# EAGLE design sensorHub (EAGLE 9.2.2)
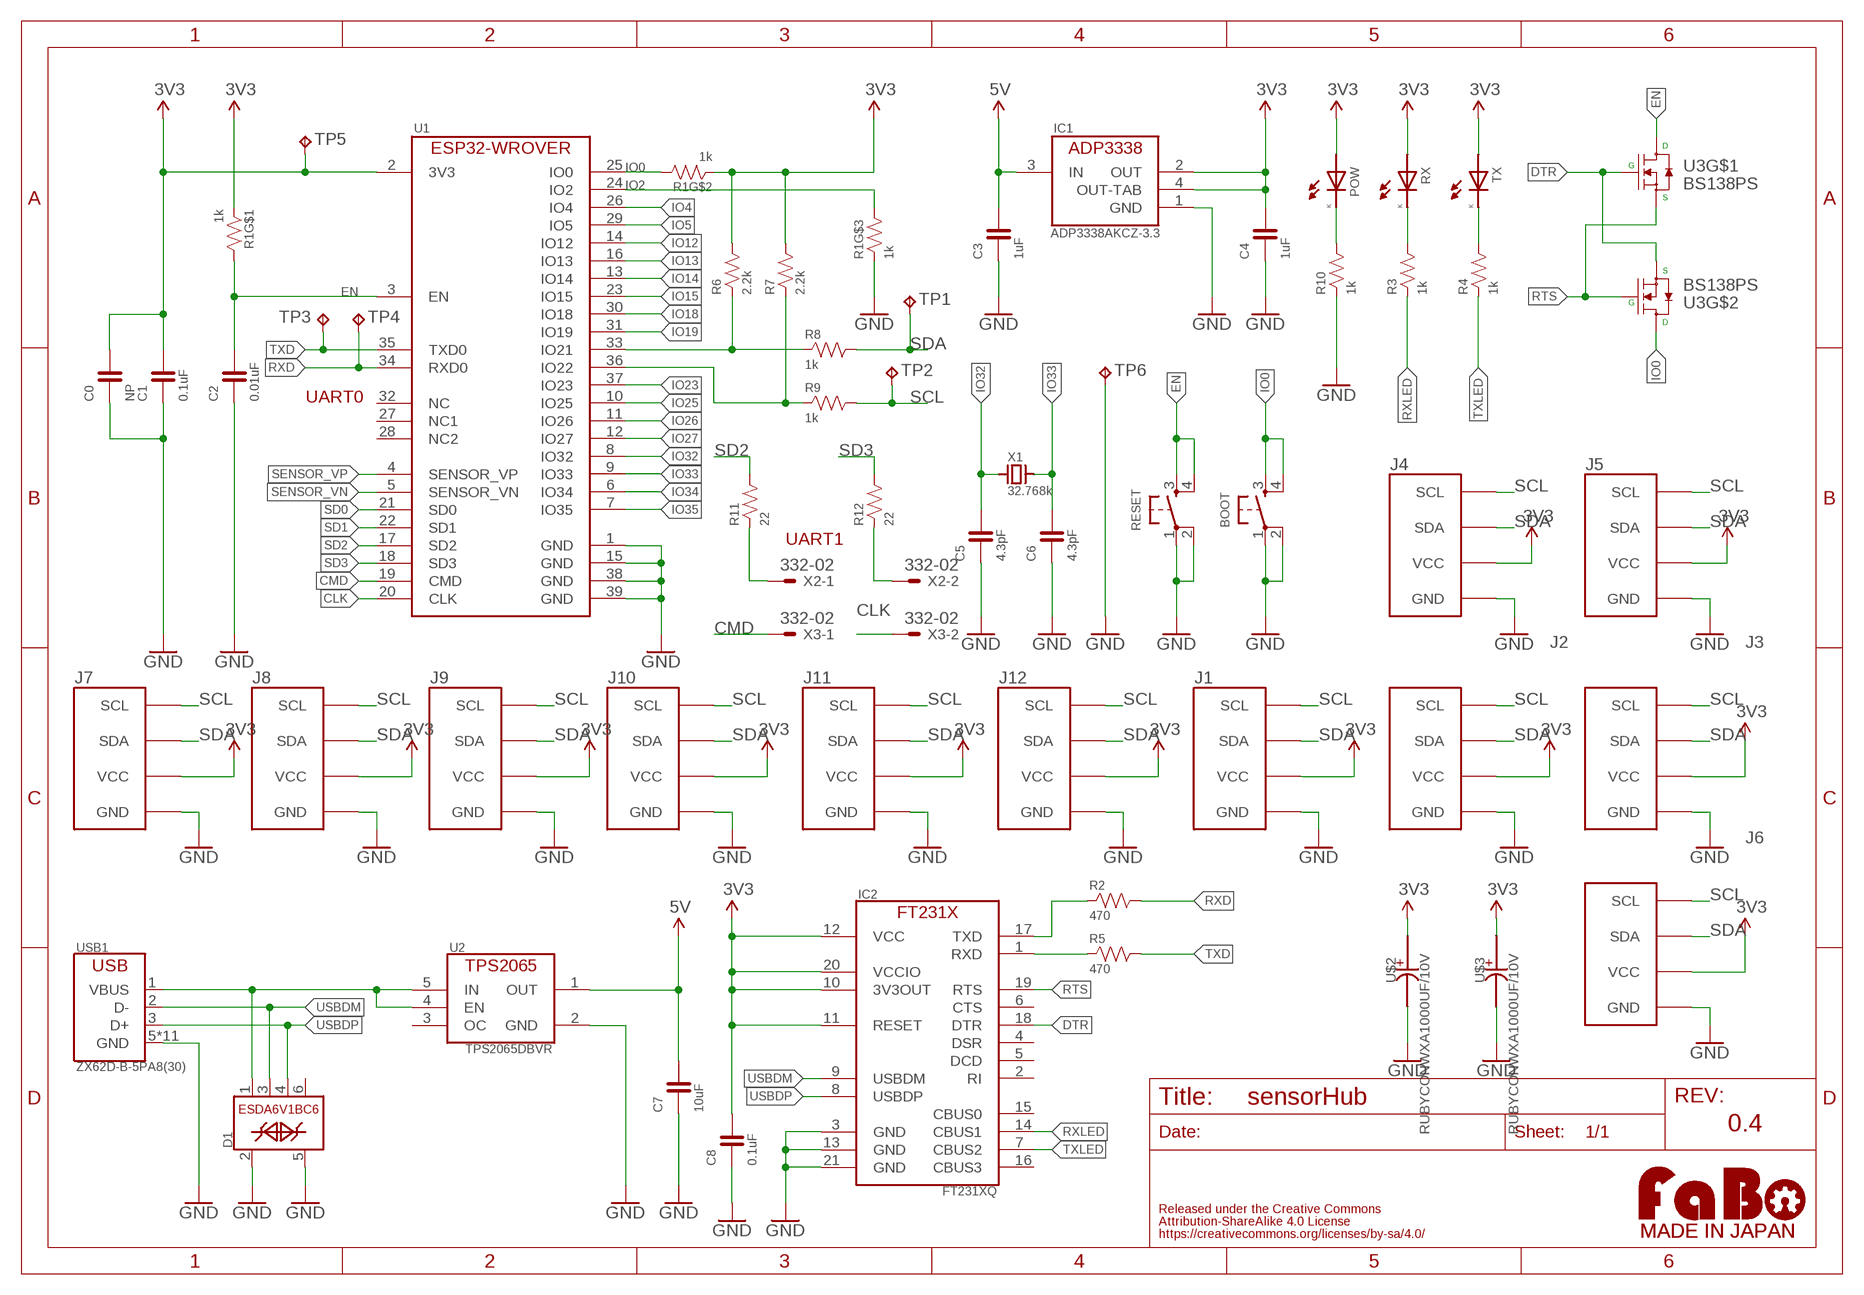
[diagram p0: schematic, sheet 1]

## Parts
BOOT  TACTILE-KMR2  [KMR2-TACT]
C0  NP  CAPACITOR-M  [MULTIPAD0603]
C1  0.1uF  CAPACITOR-0603  [EIA0603]
C2  0.01uF  CAPACITOR-0603  [EIA0603]
C3  1uF  CAPACITOR-0603  [EIA0603]
C4  1uF  CAPACITOR-0603  [EIA0603]
C5  4.3pF  CAPACITOR-0603  [EIA0603]
C6  4.3pF  CAPACITOR-0603  [EIA0603]
C7  10uF  CAPACITOR-0603  [EIA0603]
C8  0.1uF  CAPACITOR-0603  [EIA0603]
D1  ESDA6V1BC6  [SOT-23-6L]
IC1  ADP3338AKCZ-3.3  ADP3338AKCZ  [SOT-223-KC3]
IC2  FT231XQ  [QFN-20]
J1  FABO_BRICK_I2C-S04B-PASK-2  [FABO_BRICK_I2C_S04B-PASK-2]
J2  FABO_BRICK_I2C-S04B-PASK-2  [FABO_BRICK_I2C_S04B-PASK-2]
J3  FABO_BRICK_I2C-S04B-PASK-2  [FABO_BRICK_I2C_S04B-PASK-2]
J4  FABO_BRICK_I2C-S04B-PASK-2  [FABO_BRICK_I2C_S04B-PASK-2]
J5  FABO_BRICK_I2C-S04B-PASK-2  [FABO_BRICK_I2C_S04B-PASK-2]
J6  FABO_BRICK_I2C-S04B-PASK-2  [FABO_BRICK_I2C_S04B-PASK-2]
J7  FABO_BRICK_I2C-S04B-PASK-2  [FABO_BRICK_I2C_S04B-PASK-2]
J8  FABO_BRICK_I2C-S04B-PASK-2  [FABO_BRICK_I2C_S04B-PASK-2]
J9  FABO_BRICK_I2C-S04B-PASK-2  [FABO_BRICK_I2C_S04B-PASK-2]
J10  FABO_BRICK_I2C-S04B-PASK-2  [FABO_BRICK_I2C_S04B-PASK-2]
J11  FABO_BRICK_I2C-S04B-PASK-2  [FABO_BRICK_I2C_S04B-PASK-2]
J12  FABO_BRICK_I2C-S04B-PASK-2  [FABO_BRICK_I2C_S04B-PASK-2]
LOGO1  LOGO_FABO-M_BOTTOM  [LOGO_FABO_M_BOTTOM]
POW  LED-0603  [LED_0603]
R1  1k  RESISTOR_ARRAY  [EXBV8V]
R2  470  RESISTOR-0603  [EIA0603]
R3  1k  RESISTOR-0603  [EIA0603]
R4  1k  RESISTOR-0603  [EIA0603]
R5  470  RESISTOR-0603  [EIA0603]
R6  2.2k  RESISTOR-0603  [EIA0603]
R7  2.2k  RESISTOR-0603  [EIA0603]
R8  1k  RESISTOR-0603  [EIA0603]
R9  1k  RESISTOR-0603  [EIA0603]
R10  1k  RESISTOR-0603  [EIA0603]
R11  22  RESISTOR-0603  [EIA0603]
R12  22  RESISTOR-0603  [EIA0603]
RESET  TACTILE-KMR2  [KMR2-TACT]
RX  LED-0603  [LED_0603]
TP1  TPB1,27  [B1,27]
TP2  TPB1,27  [B1,27]
TP3  TPB1,27  [B1,27]
TP4  TPB1,27  [B1,27]
TP5  TPB1,27  [B1,27]
TP6  TPB1,27  [B1,27]
TX  LED-0603  [LED_0603]
U1  ESP32-WROVER-B  [ESP32-WROVER-B]
U2  TPS2065DBVR  TPS2065DBV  [SOT-23-5]
U3  BS138PS  [SOT-363]
U$2  RUBYCONWXA1000UF/10V  [ALUMINUM10*9]
U$3  RUBYCONWXA1000UF/10V  [ALUMINUM10*9]
USB1  ZX62D-B-5PA8(30)  USB-ZX62D  [ZX62D-B-5PA8]
X1  32.768k  CRYSTAL-ABS07  [ABS07]
X2  332-02  [332-02]
X3  332-02  [332-02]

## Nets
3V3: C0.2 C1.2 C4.2 C8.2 IC1.2(OUT) IC1.4(OUT-TAB) IC2.10(3V3OUT) IC2.11(RESET) IC2.12(VCC) IC2.20(VCCIO) J1.VCC J2.VCC J3.VCC J4.VCC J5.VCC J6.VCC J7.VCC J8.VCC J9.VCC J10.VCC J11.VCC J12.VCC POW.A(ANODE) R1.1 R1.2 R6.2 R7.2 RX.A(ANODE) TP5.TP TX.A(ANODE) U1.2(3V3) U$2.PLUS(+) U$3.PLUS(+)
5V: C3.2 C7.2 IC1.3(IN) U2.1(OUT)
CLK: U1.20(CLK) X3.2
CMD: U1.19(CMD) X3.1
DTR: IC2.18(DTR) U3.2(G) U3.4(S)
EN: C2.2 R1.8 RESET.3 RESET.4 U1.3(EN) U3.6(D)
GND: BOOT.1 BOOT.2 C0.1 C1.1 C2.1 C3.1 C4.1 C5.1 C6.1 C7.1 C8.1 D1.2 D1.5 IC1.1(GND) IC2.3(GND) IC2.13(GND) IC2.21(GND) J1.GND J2.GND J3.GND J4.GND J5.GND J6.GND J7.GND J8.GND J9.GND J10.GND J11.GND J12.GND R1.3 R10.1 RESET.1 RESET.2 TP6.TP U1.1(GND) U1.15(GND) U1.38(GND) U1.39(GND) U2.2(GND) U$2.MINUS(-) U$3.MINUS(-) USB1.5(GND) USB1.B1(GND) USB1.B2(GND) USB1.B3(GND) USB1.B4(GND) USB1.T1(GND) USB1.T2(GND) USB1.T3(GND) USB1.T4(GND) USB1.T5(GND) USB1.T6(GND)
IO0: BOOT.3 BOOT.4 R1.7 U1.25(IO0) U3.3(D)
IO2: R1.6 U1.24(IO2)
IO4: U1.26(IO4)
IO5: U1.29(IO5)
IO12: U1.14(IO12)
IO13: U1.16(IO13)
IO14: U1.13(IO14)
IO15: U1.23(IO15)
IO18: U1.30(IO18)
IO19: U1.31(IO19)
IO23: U1.37(IO23)
IO25: U1.10(IO25)
IO26: U1.11(IO26)
IO27: U1.12(IO27)
IO32: C5.2 U1.8(IO32) X1.1
IO33: C6.2 U1.9(IO33) X1.2
IO34: U1.6(IO34)
IO35: U1.7(IO35)
LED1K: POW.K(CATHODE) R10.2
LED2K1: R3.2 RX.K(CATHODE)
LED2K2: R4.2 TX.K(CATHODE)
N$1: IC2.1(RXD) R5.1
N$2: R11.1 X2.1
N$3: IC2.17(TXD) R2.1
N$4: R12.1 X2.2
N$5: R6.1 R8.1 U1.33(IO21)
N$6: R7.1 R9.1 U1.36(IO22)
RTS: IC2.19(RTS) U3.1(S) U3.5(G)
RXD: R2.2 TP4.TP U1.34(RXD0)
RXLED: IC2.14(CBUS1) R3.1
SCL: J1.SCL J2.SCL J3.SCL J4.SCL J5.SCL J6.SCL J7.SCL J8.SCL J9.SCL J10.SCL J11.SCL J12.SCL R9.2 TP2.TP
SD0: U1.21(SD0)
SD1: U1.22(SD1)
SD2: R11.2 U1.17(SD2)
SD3: R12.2 U1.18(SD3)
SDA: J1.SDA J2.SDA J3.SDA J4.SDA J5.SDA J6.SDA J7.SDA J8.SDA J9.SDA J10.SDA J11.SDA J12.SDA R8.2 TP1.TP
SENSOR_VN: U1.5(SENSOR_VN)
SENSOR_VP: U1.4(SENSOR_VP)
TXD: R5.2 TP3.TP U1.35(TXD0)
TXLED: IC2.7(CBUS2) R4.1
USBDM: D1.3 IC2.9(USBDM) USB1.2(D-)
USBDP: D1.4 IC2.8(USBDP) USB1.3(D+)
USBVBUS: D1.1 U2.4(EN) U2.5(IN) USB1.1(VBUS)
Unconnected: D1.6 IC2.2(RI) IC2.4(DSR) IC2.5(DCD) IC2.6(CTS) IC2.15(CBUS0) IC2.16(CBUS3) R1.4 R1.5 U1.27(NC1) U1.28(NC2) U1.32(NC) U2.3(OC)

## Notes on the sheet
- UART0
- UART1
- 0.4

## Library data of the parts
BOOT RESET = component:TACTILE
C0 C1-C8 = component:CAPACITOR
D1 = component:ESDA6V1BC6
IC1 = component:ADP3338AKCZ
IC2 = component:FT231X
J1-J12 = FaBo-Template:FABO_BRICK_I2C: FaBo Brick I2C
LOGO1 = component:LOGO_FABO
POW RX TX = component:LED
R1 = component:RESISTOR_ARRAY
R2-R12 = component:RESISTOR
TP1-TP6 = testpad:TP: Test pad
U1 = component:ESP32-WROVER-B
U2 = component:TPS2065
U3 = component:BS138PS
U$2 U$3 = FaBo-Capacitor:RUBYCONWXA1000UF/10V
USB1 = component:USB
X1 = component:CRYSTAL
X2 X3 = con-garry:332-02: 2 Pin - 2mm Dual Row Source: www.mpe-connector.de / garry_shortform_2012.pdf

## Board
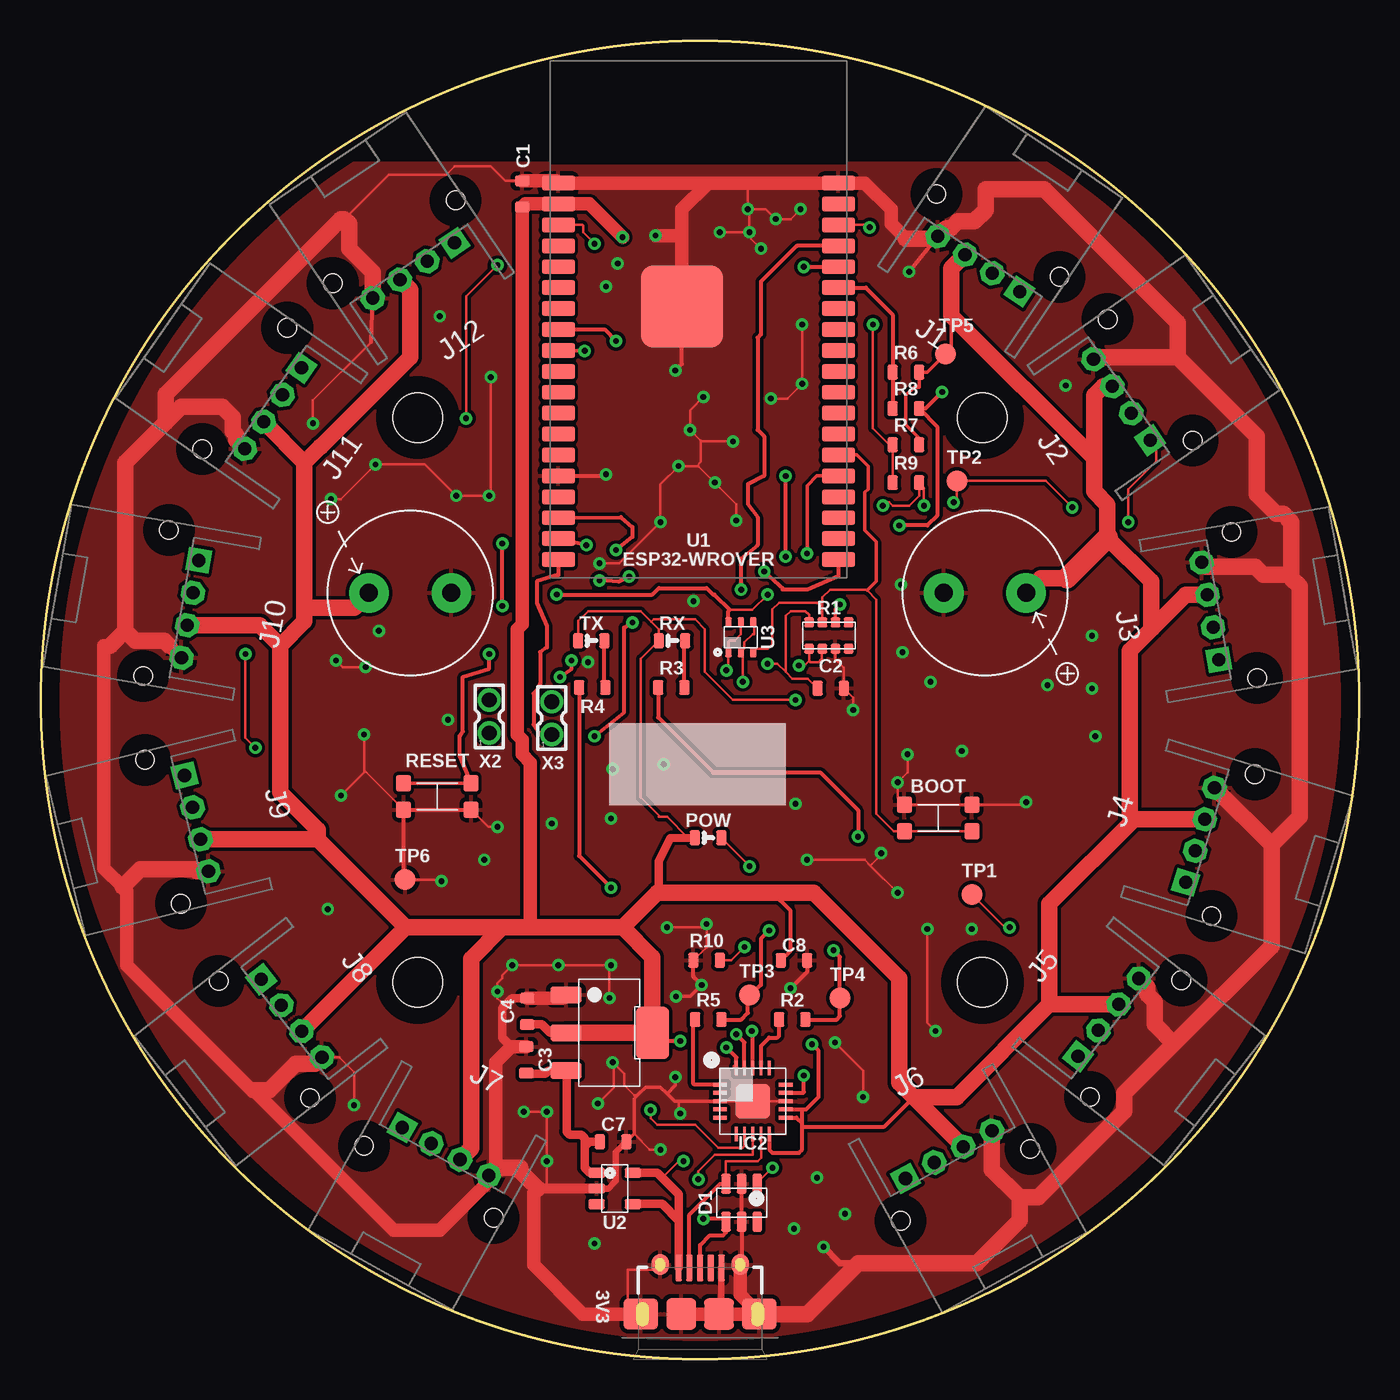
[diagram p1: board, top side]
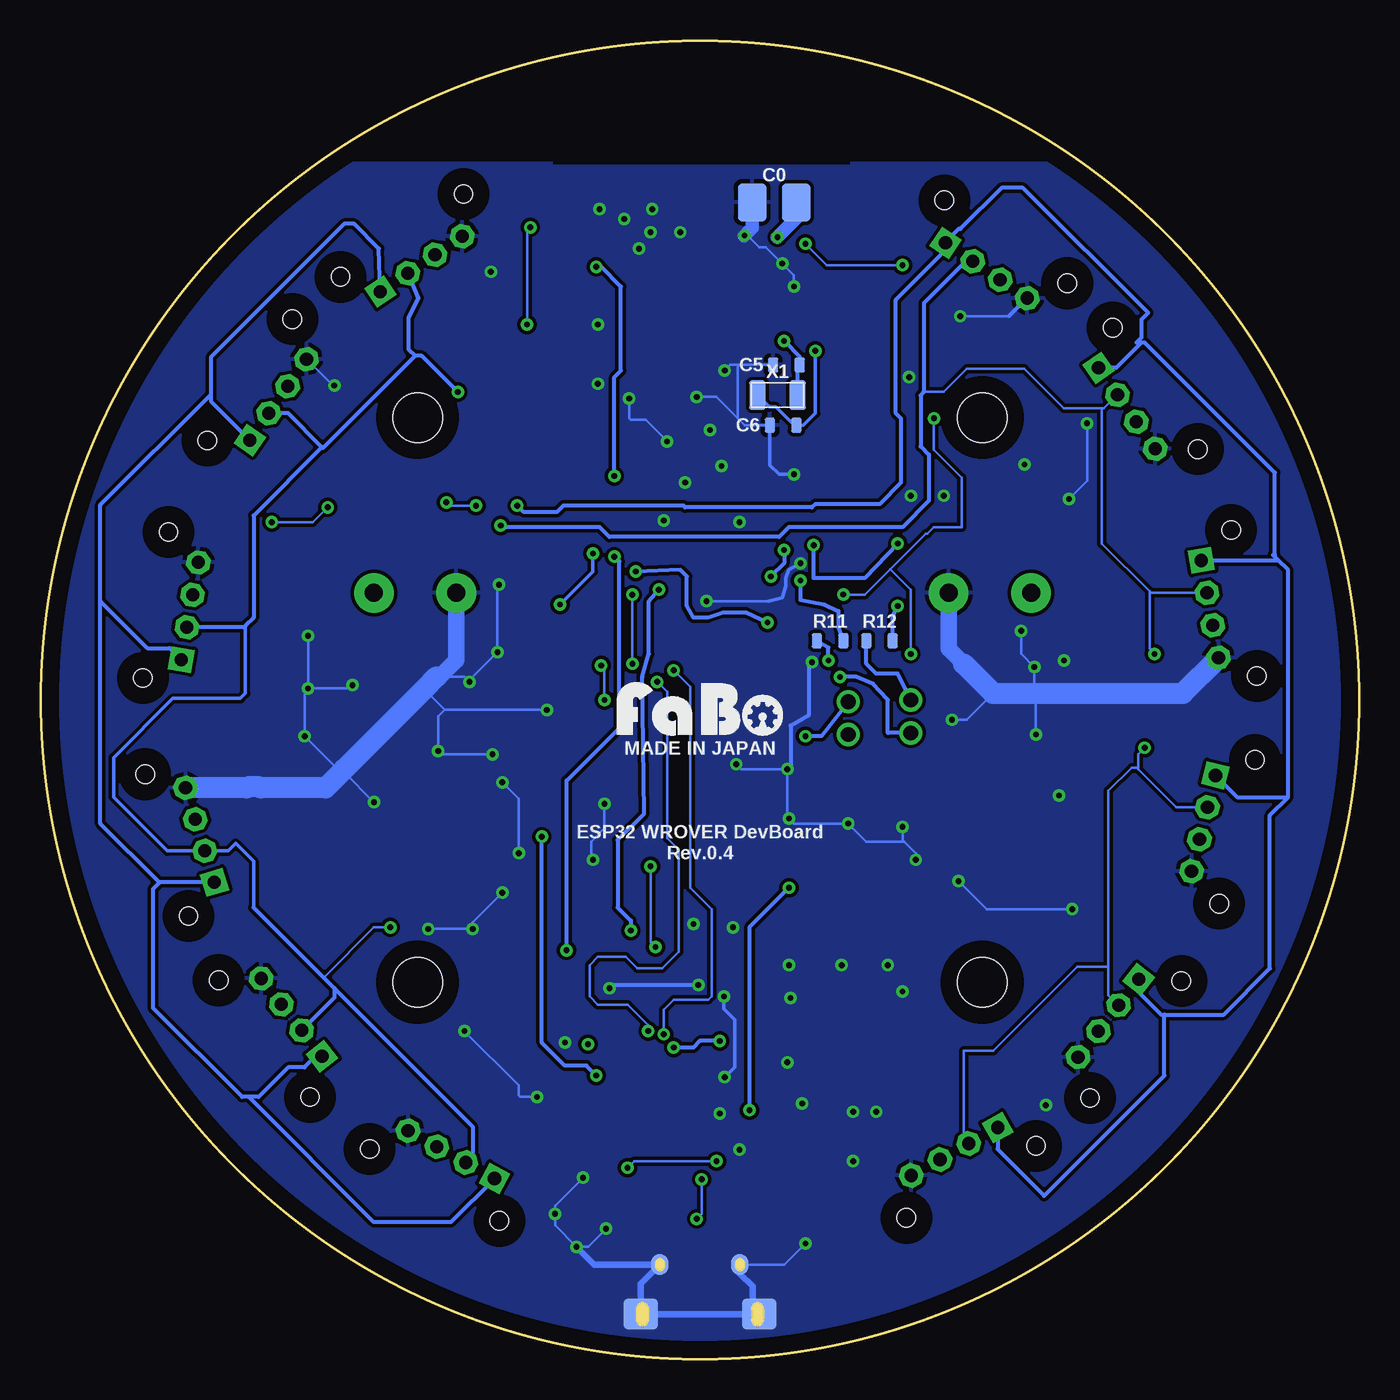
[diagram p2: board, bottom side, seen from below]

Size 80 x 80 mm. Coordinates in mm from the lower left corner, seen from the top.
Outline: circle at 40,40 radius 40
Copper layers (1*16): Top 0.035mm / dielectric 1.5mm / Bottom 0.035mm
Design rules "PCBway": minimum track width 6mil, minimum drill 0.3mm, track to track 0.205mm, track to pad 0.205mm, pad to pad 0.205mm, via to via 0.205mm, smd to smd 8mil, copper to edge 40mil, drill to drill 8mil, minimum pad ring 10mil, minimum via ring 8mil, stop-mask expansion 4mil, vias tented up to drill 25mil, thermal gap 10mil
Holes 3 mm at 22.86,57.15 22.86,22.86 57.15,22.86 57.15,57.15
tRestrict: area 15.5,72.7 to 65.1,83.6
bRestrict: area 15.5,72.7 to 65.1,83.6

### Footprints (pad centres in the part's own frame; a part is rotated, then mirrored left to right if it is on the bottom)
KMR2-TACT = smd 0.9 x 1: 1 -2.05,0.8; 2 2.05,0.8; 3 2.05,-0.8; 4 -2.05,-0.8
MULTIPAD0603 = smd 1.725 x 2.3: 1 -1.337,0; 2 1.337,0
EIA0603 = smd 0.65 x 0.9: 1 -0.8,0; 2 0.8,0
SOT-23-6L = smd 0.6 x 1.2: 1 -0.95,-1.15; 2 0,-1.15; 3 0.95,-1.15; 4 0.95,1.15; 5 0,1.15; 6 -0.95,1.15
SOT-223-KC3 = smd 1 x 1.9: 1 -2.3,-2.625; 2 0,-2.625; 3 2.3,-2.625 | smd 3.15 x 2: 4 0,2.625
QFN-20 = smd 0.9 x 0.25: 1 -2,1; 2 -2,0.5; 3 -2,0; 4 -2,-0.5; 5 -2,-1; 11 2,-1; 12 2,-0.5; 13 2,0; 14 2,0.5; 15 2,1 | smd 0.25 x 0.9: 6 -1,-2; 7 -0.5,-2; 8 0,-2; 9 0.5,-2; 10 1,-2; 16 1,2; 17 0.5,2; 18 0,2; 19 -0.5,2; 20 -1,2 | smd 2.1 x 2.1: 21 0,0
FABO_BRICK_I2C_S04B-PASK-2 = drill 0.8 pad 1.422 octagon: GND -3,0; SDA 1,0; VCC -1,0 | drill 0.8 pad 1.422 square: SCL 3,0 | hole 1.1: 4.5,2.1; -4.5,2.1
LED_0603 = smd 0.65 x 0.9: A -0.8,0; K 0.8,0
EXBV8V = smd 0.6 x 0.6: 1 -1.2,-0.8; 2 -0.4,-0.8; 3 0.4,-0.8; 4 1.2,-0.8; 5 1.2,0.8; 6 0.4,0.8; 7 -0.4,0.8; 8 -1.2,0.8
B1,27 = smd 1.27 x 1.27: TP 0,0
ESP32-WROVER-B = smd 2 x 0.9: 1 -8.5,8.26; 2 -8.5,6.99; 3 -8.5,5.72; 4 -8.5,4.45; 5 -8.5,3.18; 6 -8.5,1.91; 7 -8.5,0.64; 8 -8.5,-0.63; 9 -8.5,-1.9; 10 -8.5,-3.17; 11 -8.5,-4.44; 12 -8.5,-5.71; 13 -8.5,-6.98; 14 -8.5,-8.25; 15 -8.5,-9.52; 16 -8.5,-10.79; 17 -8.5,-12.06; 18 -8.5,-13.33; 19 -8.5,-14.6; 20 8.5,-14.6; 21 8.5,-13.33; 22 8.5,-12.06; 23 8.5,-10.79; 24 8.5,-9.52; 25 8.5,-8.25; 26 8.5,-6.98; 27 8.5,-5.71; 28 8.5,-4.44; 29 8.5,-3.17; 30 8.5,-1.9; 31 8.5,-0.63; 32 8.5,0.64; 33 8.5,1.91; 34 8.5,3.18; 35 8.5,4.45; 36 8.5,5.72; 37 8.5,6.99; 38 8.5,8.26 | smd 5 x 5: 39 -1,0.76
SOT-23-5 = smd 0.6 x 1: 1 -0.95,-1.1; 2 0,-1.1; 3 0.95,-1.1; 4 0.95,1.1; 5 -0.95,1.1
SOT-363 = smd 0.6 x 0.4: 1 -0.9,0.75; 2 -0.9,0; 3 -0.9,-0.75; 4 0.9,-0.75; 5 0.9,0; 6 0.9,0.75
ALUMINUM10*9 = drill 1.1 pad 2.4: MINUS 2.5,0; PLUS -2.5,0
ZX62D-B-5PA8 = smd 0.4 x 1.6: 1 -1.3,4.25; 2 -0.65,4.25; 3 0,4.25; 4 0.65,4.25; 5 1.3,4.25 | smd 1.05 x 1.25 bottom: B1 -2.425,4.45; B2 2.425,4.45 | smd 2.1 x 1.9 bottom: B3 -3.6,1.45; B4 3.6,1.45 | smd 1.05 x 1.25: T1 -2.425,4.45; T2 2.425,4.45 | smd 2.1 x 1.9: T3 -3.6,1.45; T6 3.6,1.45 | smd 1.8 x 1.9: T4 -1.15,1.45; T5 1.15,1.45
ABS07 = smd 1 x 1.8: 1 -1.225,0; 2 1.225,0
332-02 = drill 0.9 pad 1.27: 1 0,-1; 2 0,1

### Placement (x,y rotation side)
BOOT  54.46,32.84 0 top
C0  35.49,70.21 0 bottom
C1  29.21,70.72 270 top
C2  47.94,40.71 180 top
C3  29.45,18.15 270 top
C4  29.5,21.09 270 top
C5  34.76,60.34 0 bottom
C6  34.95,56.68 0 bottom
C7  34.73,13.18 180 top
C8  45.7,24.19 180 top
D1  42.53,9.47 180 top
IC1  34.49,19.8 270 top
IC2  43.2,15.64 0 top
J1  56.92,66.47 326 top
J2  65.61,58.23 305 top
J3  70.98,45.4 280 top
J4  70.36,31.8 253 top
J5  64.8,20.73 232 top
J6  55.1,12.4 209 top
J7  24.55,12.59 151 top
J8  15.2,20.68 128 top
J9  9.43,32.51 104 top
J10  9.04,45.52 80 top
J11  14.08,57.71 55 top
J12  22.61,66.08 34 top
LOGO1  40.01,37.47 0 top
POW  40.49,31.64 0 top
R1  47.83,43.91 0 top
R2  45.6,20.6 0 top
R3  38.26,40.76 0 top
R4  33.46,40.76 0 top
R5  40.5,20.6 0 top
R6  52.5,59.9 0 top
R7  52.5,55.5 0 top
R8  52.5,57.7 0 top
R9  52.5,53.2 0 top
R10  40.4,24.2 0 top
R11  32.1,43.6 0 bottom
R12  29.1,43.6 0 bottom
RESET  24.05,34.15 180 top
RX  38.3,43.6 0 top
TP1  56.5,28.2 0 top
TP2  55.6,53.3 0 top
TP3  43,22.1 0 top
TP4  48.5,21.9 0 top
TP5  54.9,61 0 top
TP6  22.1,29.1 0 top
TX  33.4,43.6 0 top
U1  39.91,63.12 0 top
U2  34.83,10.34 270 top
U3  42.48,43.81 90 top
U$2  22.4,46.5 0 top
U$3  57.3,46.5 180 top
USB1  40.01,1.27 0 top
X1  35.3,58.51 180 bottom
X2  27.2,39 0 top
X3  31,38.9 0 top

### Tracks (layer width: path | path; a pad name or v marks a point on that pad's centre or on a via)
3V3  (via drill 0.35)
  Top 0.152: POW.A 39.27,31.64 38,32.9 37.6,32.9 | 37.6,32.9 37.5,32.9 | 37.6,32.9 36.4,34.1 36.4,42.5 RX.A 37.5,44.3 37.05,44.75 | TX.A 32.6,44.8 33.2,45.4 36.4,45.4 37.05,44.75 | R1.1 46.62,42.38 | 46.62,42.38 46.7,42.3 47.2,42.3 47.4,42.5 47.4,43.09 R1.2 | 46.62,42.38 46.35,42.1 v46,42.1 | v45.8,40 42,40 40.3,41.7 40.3,44.3 39.7,44.9 37.2,44.9 37.05,44.75
  Top 0.203: R7.2 53.3,55.9 52.5,56.7 52.5,58.5 53,59 53.3,59 R6.2 53.8,59.9 TP5.TP 55.26,61.36 55.26,63.34
  Top 0.254: C8.2 45.5,24.79 45.5,27.2 44.4,28.3 | IC1.4 37.61,19.3 v38.8,19.3 | 42.1,17.75 IC2.20 42.2,18.3 v41.6,18.9 | IC2.12 46.3,15.14 | 46.3,15.14 46.45,15.14 47.2,15.9 47.2,18.7 v46.8,19.1 | IC2.10 44.2,12.7 44.4,12.5 46,12.5 46.2,12.7 46.2,14.1 | 46.2,14.1 46.2,14.3 | 46.2,14.3 46.2,15.04 46.3,15.14 | IC2.11 45.85,14.64 46.2,14.3 | 46.2,14.1 51.2,14.1 52.98,15.88
  Top 0.508: IC1.2 30.91,19.8 30.4,20.3 C4.2 | POW.A 38.2,31.6 37.5,30.2 37.5,28.3
  Top 0.813: v35.3,68.1 33.28,70.11 U1.2 29.41,70.11 C1.2 29.2,44.6 28.9,44.3 28.9,37.9 29.2,37.6 29.2,36.7 29.7,36.2 29.7,26.2
  Top 1.016: IC1.2 IC1.4 37.12,24.39 35.3,26.2 | 35.3,26.2 29.7,26.2 28,26.2 | 28,26.2 22.12,26.2 | 22.12,26.2 J8.VCC | J7.VCC 26.1,12.77 26.1,24.3 28,26.2 | J9.VCC 16.78,31.54 | 16.78,31.54 22.12,26.2 | J10.VCC 13.27,44.53 14.5,43.3 | J11.VCC 15.98,54.41 | 14.5,43.3 14.5,34.4 16.78,32.12 16.78,31.54 | 15.98,54.41 15.98,45.6 | 15.98,45.6 15.98,44.78 14.5,43.3 | 35.3,26.2 37.4,28.3 37.5,28.3 44.4,28.3 46.9,28.3 52.1,23.1 52.1,16.76 52.98,15.88 | 52.98,15.88 J6.VCC | J5.VCC 61.22,21.52 | 52.98,15.88 55.58,15.88 61.22,21.52 | J4.VCC 66.36,32.76 | 61.22,21.52 61.22,27.62 66.36,32.76 | J3.VCC 69.48,46.38 67.45,44.35 | 67.45,44.35 66.1,43 66.1,33.01 66.36,32.76 | J2.VCC 64.47,59.05 63.93,58.51 63.93,54.67 | 67.45,44.35 67.4,44.4 67.4,47.2 64.73,49.87 64.73,51.87 63.93,52.67 63.93,54.67 | 63.93,54.67 55.26,63.34 55.26,66.2 J1.VCC | 15.98,54.41 16.95,55.38 16.98,55.38 22.4,60.8 22.4,64.9 J12.VCC | U$2.PLUS 19,45.6 15.98,45.6 | 62.27,47.4 60.7,47.4 U$3.PLUS
  Top 1.27: 64.73,49.87 62.27,47.4
  Bottom 0.152: v46,42.1 45.8,41.9 v45.8,40
  Bottom 0.254: v38.8,19.3 40,19.3 40.4,18.9 v41.6,18.9
  Bottom 0.813: v35.3,68.1 34.16,69.24 C0.2
5V
  Top 0.508: U2.1 33.31,11.29 33,11.6 33,12.9 | 33,12.9 33.28,13.18 C7.2 | 33,12.9 33,13.4 32.8,13.6 32.1,13.6 31.9,13.8 31.9,17.46 IC1.3 30.8,17.5 30.6,17.3 29.5,17.3 C3.2
CLK  (via drill 0.35)
  Top 0.254: U1.20 48.4,47.5 46.5,46.7 45.1,46.7 | 45.1,46.7 45,46.7 | 45.1,46.7 v43.9,47.8 | v33.59,37.8 35.4,39.26 35.4,44.4 v35.9,44.7
  Bottom 0.254: X3.2 32.63,37.8 v33.59,37.8 | v35.9,44.7 37.2,45.3 38.6,45.3 39.5,45 40.4,45 40.8,45.7 40.8,47.5 41.2,47.9 v43.9,47.8
CMD
  Top 0.254: U1.19 31.4,47.6 30.1,47.2 30.1,45.9 30.7,44.5 30.7,43.2 30.3,42.9 30.3,41 30.1,40.6 29.9,40.4 29.9,38.5 30.3,37.9 X3.1
DTR  (via drill 0.35)
  Top 0.152: 43.2,19.84 v43.15,19.9 | v42.6,41.1 42.6,42.79 U3.2 42.7,43.13 42.7,43.5 43.2,44 43.3,44 43.3,44.64 U3.4
  Top 0.254: IC2.18 43.2,19.84
  Bottom 0.152: v43.15,19.9 43.15,20.25 44.4,21.5 46.2,21.5 46.7,22 46.7,23.9 46.2,24.4 44.5,24.4 43.8,23.7 42.3,23.7 41.3,24.7 41.3,30.9 42,31.6 42,40.5 v42.6,41.1
EN  (via drill 0.35)
  Top 0.152: v25.8,57.1 25.8,64.5 v27.7,66.4 | v33.6,67.7 32.9,68.4 32.9,68.8 32.85,68.84 U1.3 | C2.2 46.55,41.3 45.6,41.3 45.2,41.7 | R1.8 46.62,45.17 46.4,45.4 45.5,45.4 45.2,45.1 45.2,41.7 | 45.2,41.7 44.7,42.2 v44.1,42.2 | v44.11,46.39 43.18,45.47 41.8,45.47 41.73,45.47
  Top 0.203: RESET.3 RESET.4
  Top 0.254: RESET.4 25.4,36.6 25.4,37.8 25.6,38.1 25.6,41.4 27.2,41.9 v27.2,42.8 | v31.3,46.4 37.1,46.4 37.5,46.8 40.4,46.8 40.8,46.4 40.87,46.4 41.8,45.47 41.73,45.4 U3.6
  Bottom 0.152: v31.3,46.4 30,46.4 28.45,47.95 | v25.8,57.1 25.8,55.2 24.1,53.5 24.1,50.5 25.8,50.5 26.2,50.1 26.3,50.1 28.45,47.95 | v27.7,66.4 32.3,66.4 v33.6,67.7 | v27.2,42.8 27.2,46.7 28.45,47.95 | v44.1,42.2 v44.1,46.39 v44.11,46.39
GND  (via drill 0.35)
  Top 0.152: C1.1 28.18,71.52 27.3,72.4 25.1,72.4 24.6,71.9 21.1,71.9 18.4,69.2 | v59.8,33.8 59.65,33.65 BOOT.2 BOOT.1 52,34.05 v52,35 52.6,35.6 v52.6,36.7 | R1.3 48.23,42.48 48.74,41.96 C2.1 49.3,40.15 v49.3,39.4 | RESET.2 19.6,35.74 | 19.6,35.74 v19.6,37.9 | USB1.T3 35.6,3.52 35.6,5.4 37.26,5.4 USB1.T1 | IC2.3 IC2.21 IC2.13 | v41.2,68.4 v43,68.4 | v43,68.4 43,69.7 v42.9,69.8 | v42.9,69.8 42.9,71.39 | v42.9,69.8 44,69.8 v44.6,69.2 45.5,69.2 v46.1,69.8 | v43,68.4 43,68.1 v43.7,67.4 | v46.2,62.8 v46.2,59.2 45.3,58.3 v44.3,58.3 | v42,55.7 40.1,55.7 40.05,55.75 | 40.05,55.75 v39.4,56.4 39.4,57.6 v40.2,58.4 | 39.8,54.2 v38.7,54.2 37.6,53.1 v37.6,50.8 35.1,48.3 v33.9,48.3 | 39.8,54.2 39.9,54.2 v40.9,53.2 42.2,51.9 v42.2,50.9 | 39.8,54.2 40.05,54.45 40.05,55.75 | 27.1,52.4 v25.2,52.4 23.3,54.3 v20.3,54.3 18.2,52.2 v17.6,52.2 | 27.1,52.4 v27.2,52.4 | v27.3,59.6 27.3,52.6 27.1,52.4 | RESET.1 27.14,32.3 v27.7,32.3 | v24.3,29 24.2,29.1 TP6.TP | v18.2,34.2 19.6,35.6 19.6,35.74 | v17.9,42.4 18.3,42 v19.7,42 | v46.5,30.3 50,30.3 50.35,29.95 | 50.35,29.95 v52,28.3 | v51,30.7 51,30.6 50.35,29.95 | R10.1 40.4,25 v40.4,26.4 40.2,26.2 v38,26.2 | v34.5,21.9 34.5,23.8 v34.6,23.9 v31.4,23.9 v28.6,23.9 28,23.3 28,23.1 27.7,22.8 v27.7,22.3 27.7,21.9 28,21.6 28,21.3 | v34.7,18 34.75,17.95 | 34.75,17.95 35.4,17.3 35.4,16.6 36,16 36.2,16 | v33.8,15.5 34.75,16.45 34.75,17.95 | v29.3,15 v30.7,15 v30.7,12 30.7,10.64 30.4,10.34 | v48.2,19.2 49.9,17.5 v49.9,15.9 | v54.3,19.9 53.8,20.4 v53.8,26.1 | v16.5,56.8 16.5,58.2 20.03,61.73 | 36,13.65 36.95,12.7 v37.6,12.7 | v38.8,14.9 38.7,15 38.7,15.64 | v19,15.4 19,17.4 18.08,18.32 J8.GND
  Top 0.203: C7.1 36,13.65 36,15.8 36.2,16 36.7,16.5 37.6,16.5 38,16.1 | IC2.3 38.7,15.64 38.45,15.64 38,16.1 | v40.1,22.7 39.4,22 v38.54,22 | v38.5,17.1 38.5,16.6 38,16.1
  Top 0.254: U1.15 34.2,53.6 v34.3,53.7 | v38.5,60 38.91,60.41 U1.39 | 30.82,71.39 U1.1 | TP6.TP 22,29.2 RESET.2 RESET.1 | USB1.T2 42.53,5.82 D1.5 D1.2 | C8.1 46.51,23.5 v45.5,22.5 | v40.1,22.7 39.6,23.2 R10.1 | 20.03,61.73 J12.GND | v52.7,66 J1.GND
  Top 0.406: USB1.5 41.3,2.87 USB1.T5 | U2.2 34.44,10.34 34.9,10.8 34.9,12.55 C7.1 | 45.11,2.73 45.1,2.72 | USB1.T3 36.41,2.91 | 49.6,5.8 48.5,5.8 v47.5,6.8
  Top 0.508: 28.55,18.95 28,19.5 28,21.3 28.6,21.9 28.61,21.89 C4.1
  Top 0.61: U2.2 30.4,10.34 30.14,10.34 29.9,10.1
  Top 0.813: C1.1 31.27,71.52 U1.1 40.5,71.39 | IC1.1 31.66,21.89 C4.1 | C3.1 28.55,18.95 27.6,18 27.6,11.55 J7.GND 27.18,10.78 24.2,7.8 21.4,7.8 12.9,16.3 12.8,16.4 12.7,16.4 5.2,23.9 5.2,28.4 4.95,28.65 3.8,29.8 3.8,43.3 4.2,43.3 | USB1.T3 32.88,2.72 29.9,5.7 29.9,10.1 | J9.GND 10.06,29.5 | J10.GND 7.79,43.3 | 40.5,71.39 42.9,71.39 U1.38 50.02,71.39 51.6,69.8 51.6,68.9 52.5,68 | U1.39 38.91,68.2 | 38.91,68.2 38.91,69.79 40.5,71.39 | v37.3,68.2 38.91,68.2 | USB1.T4 USB1.T5 USB1.T6 42.43,3.9 USB1.T2
  Top 1.016: USB1.T6 45.1,2.72 46.52,2.72 49.6,5.8 56.8,5.8 59.4,8.4 59.4,9.8 | J6.GND 57.72,11.48 59.4,9.8 | J4.GND 74.7,31.21 | 68.77,19.13 74.7,25.05 74.7,31.21 | 68.77,19.13 65.76,16.11 65.76,15.03 60.53,9.8 59.4,9.8 | 75.9,47.4 75.7,47.6 74.2,47.6 73.7,48.1 70.71,48.1 J3.GND | 75.9,47.4 76.4,46.9 76.4,32.91 74.7,31.21 | J2.GND 64,60.8 69,60.8 | 75.9,47.4 75.9,50.8 75.4,51.3 75,51.3 73.8,52.5 73.8,56 69,60.8 | 69,60.8 69,62.9 60.9,71 57.35,71 57.35,69.75 56.66,69.06 55.63,69.06 55.22,68.65 54.94,68.65 J1.GND 54.29,68 52.5,68 | 7.55,56.85 5.1,54.4 5.1,44.2 | 5.1,44.2 4.2,43.3 | 7.55,56.85 7.55,58.55 18.2,69.2 18.4,69.2 18.7,68.9 18.7,67.4 20.12,65.98 J12.GND | J5.GND 67.15,22.59 67.15,22.12 67.6,21.68 67.6,20.3 68.77,19.13 | J9.GND 9.45,29.6 9.34,29.71 6.01,29.71 4.95,28.65 | J8.GND 16.65,17.91 15.46,17.91 13.84,16.3 12.9,16.3 | J7.GND 27.65,11.6 29.1,11.6 29.1,11.38 30.14,10.34 | 7.79,43.3 7.49,43.6 5.7,43.6 5.1,44.2 | J11.GND 11.85,55.76 11.85,56.09 11.62,56.32 11.62,57.18 11,57.8 8.5,57.8 7.55,56.85
  Bottom 0.152: v59.8,33.8 61.6,35.6 61.6,35.8 62,35.8 v64,37.8 64,40.5 v63.8,40.7 | v49.3,39.4 55.5,39.4 | 55.5,39.4 56.75,40.65 | v19.6,37.9 19.6,40.4 19.7,40.5 v19.7,42 20.5,42.8 v20.5,44.2 | C5.1 37.56,60.34 | C6.1 37.28,56.68 37.7,57.1 | 37.56,60.34 37.7,60.2 37.7,57.1 | 37.7,57.1 39,58.4 v40.2,58.4 | v24.2,63.3 21.25,63.3 | v34.3,65.1 34.3,65.8 v35,66.5 36,67.5 36.4,67.5 37.1,68.2 v37.3,68.2 | v42,55.7 43.3,57 44.2,57 44.3,57.1 v44.3,58.3 | v39.6,46 35.87,46 | v37.8,36.1 37.5,35.8 v34.7,35.8 34.7,35.7 34.7,32.9 v34.6,32.8 34.3,32.5 v31,32.5 29.9,31.4 27.7,31.4 | 27.7,31.4 27.6,31.4 26.9,30.7 v26.9,30.3 | v27.7,32.3 27.7,31.4 | v17.4,27.3 22.6,27.3 v24.3,29 | v45.8,33.7 45.8,32.2 46.6,31.4 46.6,30.4 v46.5,30.3 | v52,35 51,34 v51,30.7 | 55.5,39.4 55.9,39 v55.9,36.9 55.7,36.7 v52.6,36.7 | v61.1,40.9 61.3,40.7 v63.8,40.7 | v63.8,40.7 v63.8,43.9 | v52.2,47 52.3,46.9 v52.3,42.9 54,41.2 v54,41.1 54.3,41.4 55.8,41.4 56,41.4 | v52,28.3 53.8,26.5 v53.8,26.1 v56.5,26.1 | v54.3,19.9 51,16.6 51,16 50.9,15.9 v49.9,15.9 | v45.7,7.9 46.8,6.8 v47.5,6.8 48.8,8.1 v48.8,8.8 48.8,9.3 v47.1,11 | v33.6,7 34.88,5.72 USB1.T1 | J2.GND 62.3,59.1 v62.2,59.1 | v17.6,52.2 16.5,53.3 v16.5,56.8 | 22.2,40.4 23.8,38.8 v24.7,38.8 | 37.56,60.34 38.16,60.34 v38.5,60
  Bottom 0.203: C6.1 35.76,54.26 35.2,53.7 v34.3,53.7 | v38.54,22 38.54,21.24 37.9,20.6 37.9,17.7 v38.5,17.1 | 35.87,46 35,46.2 34.8,46.9 34.8,47.4 34.6,47.9 v33.9,48.3
  Bottom 0.254: v45.5,22.5 45.3,22.7 v40.1,22.7 | 21.25,63.3 20.15,64.4 J12.GND | v33.2,42.3 33.4,42.1 33.4,39.07 34.5,38.44 34.5,35.83 34.7,35.7
  Bottom 0.406: v47.5,6.8 46.42,5.72 USB1.T2 43.6,4.54 USB1.T6 USB1.T3 36.8,3.12 36.8,4.4 37.58,5.18 USB1.T1
  Bottom 0.813: C0.1 36.83,68.67 v37.3,68.2
  Bottom 1.016: U$2.MINUS 24.9,43.1 24,42.2 | U$3.MINUS 54.8,42.4 55.8,41.4
  Bottom 1.27: 24,42.2 22.2,40.4 19.6,40.4 10.69,40.4 J10.GND | J4.GND 67.54,34.67 67.48,34.73 66.72,34.73 66.66,34.67 62.73,34.67 61.6,35.8 56.75,40.65 56,41.4
  pour Bottom (rank 2, no thermals): 34.92,1.27 34.92,4.45 36.2,4.45 36.2,6.99 43.81,6.99 43.81,4.45 45.09,4.45 45.09,1.27
  pour Top (rank 2, no thermals): 41.2,17.65 45.21,17.65 45.21,13.64 41.2,13.64
  pour Top (rank 2, no thermals): 41.78,66.68 41.78,60.99 36.09,60.99 36.09,66.68
  pour Bottom: 0,0 0,80.01 81.28,80.01 81.28,0
  pour Top: 0,0 0,80.01 81.28,80.01 81.28,0
  pour Top: 35,1.3 35,4.4 36.2,4.4 36.2,6.9 43.8,6.9 43.8,4.5 43.9,4.4 45.1,4.4 45.1,1.3
IO0
  Top 0.152: BOOT.3 BOOT.4 51.76,32.05 50.7,33.1 50.7,46.1 50.15,46.65 50.1,46.7 47.9,46.7 47.42,46.23 47.42,45.6 | 47.42,45.6 R1.7 | U3.3 43.42,43.1 44.1,43.1 44.4,43.4 44.4,45.5 44.8,45.9 47.12,45.9 47.42,45.6
  Top 0.203: U1.25 49.52,54.88 50.2,54.2 50.2,52.8 50,52.6 50,50.3 50.7,49.6 50.7,47.2 50.15,46.65
IO2  (via drill 0.35)
  Top 0.203: R1.6 48.23,45.52 v48.5,45.8 | v46.5,48.9 46.5,53 47.1,53.6 U1.24
  Bottom 0.203: v48.5,45.8 46.5,47.8 v46.5,48.9
IO32  (via drill 0.35)
  Top 0.254: U1.8 34.2,62.49 v34.9,61.8
  Bottom 0.254: X1.1 34.07,60.23 C5.2 33.95,60.85 v34.9,61.8
IO33  (via drill 0.35)
  Top 0.203: v33,61.2 31.43,61.2 U1.9
  Bottom 0.203: X1.2 35.81,57.8 35.4,57.8 34.28,56.68 C6.2 33.72,56.68 33,57.4 v33,61.2
LED1K  (via drill 0.35)
  Top 0.152: v43,29.9 43,29.93 POW.K | v42.7,25 41.9,24.2 R10.2
  Bottom 0.152: v43,29.9 43,25.3 v42.7,25
LED2K1
  Top 0.254: R3.2 39.05,43.55 RX.K
LED2K2
  Top 0.254: R4.2 34.2,40.82 TX.K
N$1
  Top 0.152: IC2.1 41.2,16.6
  Top 0.254: IC2.1 39.66,16.64 39.6,16.7 39.6,20.5 R5.1
N$2  (via drill 0.35)
  Top 0.254: v31.5,41.4 32.2,41.9 v32.2,42.4
  Bottom 0.254: X2.1 28.6,38 28.6,40 29.5,41 30.5,41.4 v31.5,41.4 | v32.2,42.4 32.2,43.2 R11.1
N$3
  Top 0.254: IC2.17 43.7,19 44.2,19.5 44.7,19.5 44.8,19.6 R2.1
N$4
  Bottom 0.254: X2.2 28,41.6 29.3,41.6 29.9,42.2 R12.1
N$5
  Top 0.254: U1.33 50.06,65.03 51.7,63.4 R6.1 R8.1
N$6  (via drill 0.35)
  Top 0.152: R9.1 R7.1 51.5,55.5 50.5,56.5 v50.5,62.8 | v50.3,68.7 50.16,68.84 U1.36
  Bottom 0.152: v50.5,62.8 50.5,68.5 v50.3,68.7
RTS  (via drill 0.35)
  Top 0.152: v42.21,19.7 v42.2,19.71 | v41.6,41.8 41.73,41.93 U3.1 41.73,43.53 41.8,43.6 42.1,43.6 42.48,43.98 U3.5
  Top 0.254: IC2.19 42.7,19.21 v42.21,19.7
  Bottom 0.152: v42.2,19.71 42.2,21.2 41.6,21.8 39.5,21.8 39.3,22 39.3,27.3 40.6,28.6 40.6,40.8 v41.6,41.8
RXD  (via drill 0.35)
  Top 0.254: R2.2 48.3,20.6 48.5,20.8 TP4.TP 48.5,24.4 v48.1,24.8 | v45.2,48.7 v45.2,53.6 | v46.3,66.3 U1.34
  Bottom 0.254: v48.1,24.8 48.1,35.1 44.9,38.3 44.9,48.4 v45.2,48.7 | v45.2,53.6 45.2,59.6 44.8,60 44.8,65.1 46,66.3 v46.3,66.3
RXLED  (via drill 0.35)
  Top 0.254: IC2.14 46.24,16.14 46.3,16.2 v46.3,17.2 | R3.1 37.45,38.95 40.8,35.6 47.3,35.6 49.6,33.3 v49.6,31.7
  Bottom 0.254: v46.3,17.2 46.9,17.8 48.2,17.8 49.6,19.2 v49.6,31.7
SCL  (via drill 0.35)
  Top 0.152: v51.1,51.8 51.3,52 51.5,52 51.7,51.8 52.7,51.8 53.3,52.4 R9.2 53.6,52.9 v53.6,51.8 | v55.4,52 55.6,52.2 TP2.TP 61,53.3 v62.6,51.7 | v66,50.8 66,52.8 67.7,54.5 67.7,55.4 J2.SCL
  Bottom 0.152: v55.4,52 55.2,51.8 v53.6,51.8 | v62.6,51.7 63.5,50.8 v66,50.8
  Bottom 0.254: 13.2,61.7 14.73,60.17 J11.SCL | J10.SCL 9.54,48.5 4.9,48.5 | 13.2,61.7 13,61.7 5.1,53.8 5.1,48.8 5.2,48.8 4.9,48.5 | 13.2,61.7 13.5,61.7 13.2,62 13.2,63.1 12.8,63.5 20.4,71.1 21.69,71.1 24.19,68.6 24.3,68.6 25.1,67.8 J12.SCL 25.1,67.3 28.1,64.3 28.1,57.4 27.8,57.1 27.8,53.2 29.1,51.9 33,51.9 33.2,51.7 40.9,51.7 41,51.8 48.3,51.8 48.7,51.4 50.7,51.4 v51.1,51.8 | J9.SCL 7.38,34.1 4.3,34.1 | 4.3,34.1 4.3,47.9 4.9,48.5 | J8.SCL 13.35,22.95 13.7,22.6 12,20.9 11.8,20.9 | 11.8,20.9 8.2,20.9 5.4,23.7 5.4,33 4.3,34.1 | J7.SCL 21.93,12.73 19.1,9.9 11.8,17.2 11.8,20.9 | J2.SCL 69.7,58.14 69.7,58.54 | 69.7,58.54 69.7,60.8 61.6,68.9 61,68.9 59.5,67.4 J1.SCL | J3.SCL 72.2,43.15 73.55,43.15 76.4,46 | 76.4,46 76.4,51.84 69.7,58.54 | J4.SCL 72.8,28.93 | 72.8,28.93 72.83,28.93 76.4,32.5 76.4,46 | J5.SCL 63.35,18.37 64.02,17.7 65,17.7 66.8,15.9 67.4,15.9 | 72.8,28.93 73.2,28.53 73.2,21.3 67.8,15.9 67.4,15.9 | J6.SCL 55.12,8.3 59.8,8.3 67.4,15.9
SD2  (via drill 0.35)
  Top 0.254: U1.17 35.2,51.1 35.9,50.5 35.9,49.9 v34.9,49.1 | v35.7,47.5 35.07,47.18 v33.9,47.26
  Bottom 0.254: v34.9,49.1 34.9,48.3 v35.7,47.5 | v33.9,47.26 33.9,46.08 32.5,45.8 31.6,45.4 31.6,44.4 R11.2
SD3  (via drill 0.35)
  Top 0.254: v28,45.7 v28,49.5 | v33.1,49.4 U1.18
  Bottom 0.254: R12.2 28.3,45.1 v28,45.7 | v28,49.5 30,47.4 33.1,47.4 v33.1,49.4
SDA  (via drill 0.35)
  Top 0.152: TP1.TP 58.5,26.2 v58.8,26.2 | v12.4,42.8 12.4,37.7 v13,37.1
  Top 0.254: v54.7,58.7 53.7,57.7 R8.2 54.4,56.6 54.4,51.2 53.8,50.6 v52.1,50.6
  Bottom 0.152: 26.4,58.7 25.2,58.7 23.8,60.1 20.3,60.1 17.9,57.7 15.6,57.7 | 15.6,57.7 15.48,57.7 J11.SDA | J10.SDA 12.61,46.51 12.7,46.6 | 15.6,57.7 15.6,49.5 12.7,46.6 | J9.SDA 11.08,33.48 13.4,35.8 13.4,35.9 | J8.SDA 15.2,22.08 15.2,23.8 | 15.2,23.8 15.2,34.5 13.8,35.9 13.4,35.9 | J7.SDA 24,13.39 24,18.7 22.2,18.7 17.1,23.8 15.2,23.8 | v58.8,26.2 59.8,26.2 62.85,23.15 | 12.7,46.6 12.7,43.1 v12.4,42.8 | v13,37.1 13.4,36.7 13.4,35.9
  Bottom 0.203: 67.1,27.4 67.1,30.2 68.2,31.3 68.66,30.84 J4.SDA 72.34,30.84 75.6,34.1 75.6,36.5 72,40.1 67.9,40.1 67.6,40.4 67.6,44.5
  Bottom 0.254: 57.3,60.9 62.9,55.3 62.95,55.35 | 62.95,55.35 65.01,57.41 J2.SDA | 62.95,55.35 67.1,51.2 67.1,45 67.6,44.5 67.69,44.41 J3.SDA | 67.1,27.4 62.85,23.15 62.2,22.5 | 62.2,22.5 62.2,21.93 J5.SDA | 62.2,22.5 53.8,14.1 53.8,12.34 J6.SDA | v54.7,58.7 56.9,60.9 57.3,60.9 | v52.1,50.6 52,50.5 46.1,50.5 45.5,49.9 35.2,49.9 34.6,50.5 27.7,50.5 26.1,52.1 26.1,54.9 26.6,55.4 26.6,58.5 26.4,58.7 26.4,64.1 23.87,66.63 J12.SDA | J1.SDA 57.1,64.4 57.7,63.2 57.7,61.3 57.3,60.9
TXD  (via drill 0.35)
  Top 0.254: R5.2 42.5,20.6 42.9,21 42.9,21.9 | 42.9,21.9 42.9,22 TP3.TP | U1.35 45.88,67.58 43.7,65.4 43.7,62.2 43.5,62 43.5,56.4 43.9,56 43.9,53.6 42.9,53.1 42.9,51.9 43.5,51.1 43.5,49.4 42.5,48.6 v42.5,46.7 | v44.2,26 43.7,25.5 43.7,22.7 42.9,21.9
  Bottom 0.254: v44.2,26 44.2,26.6 45,27.4 45,31.5 43.4,33.1 43.5,41.4 43.1,42.8 43.1,46 v42.5,46.7
TXLED  (via drill 0.35)
  Top 0.152: IC2.7 42.7,12.9 42.6,12.8 41.09,12.8 39.7,14.2 37.4,14.2 37,14.6 v37,15.1
  Top 0.254: R4.1 32.66,30.54 v34.6,28.6
  Bottom 0.254: v34.6,28.6 37,26.2 v37,15.1
USBDM
  Top 0.152: D1.3 41.58,12 43.5,12 43.7,12.21 IC2.9
  Top 0.254: USB1.2 39.35,8.76 41.23,10.62 D1.3
USBDP  (via drill 0.35)
  Top 0.152: IC2.8 43.2,12.4 40.9,12.4 39.9,11.4 v39.9,10.9
  Top 0.254: USB1.3 40.01,6.91 40.6,7.5 41.4,7.5 41.58,7.68 D1.4 41.4,8.5 v40.2,8.5
  Bottom 0.152: v39.9,10.9 39.9,8.8 v40.2,8.5
USBVBUS  (via drill 0.35)
  Top 0.152: D1.1 43.48,10.68 v44.4,11.6 | v39,12 38.7,12 37.7,11
  Top 0.508: USB1.1 38.7,8.1 | 38.7,8.1 38.7,8.39 37.7,9.4 U2.4 | U2.5 37.41,11.29 37.7,11 38.7,10 38.7,8.11 38.7,8.1
  Bottom 0.152: v44.4,11.6 44,12 v39,12

### Text on the board
tPlace: 3V3
bPlace: MADE IN JAPAN | ESP32 WROVER DevBoard | Rev.0.4